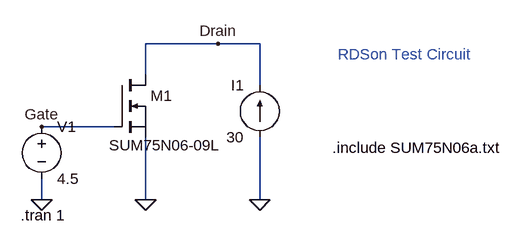
[diagram p0: schematic mosfet_test_circuit_rds.asc]
mosfet_test_circuit_rds.asc, the LTspice schematic file:
Version 4
SHEET 1 880 680
WIRE 320 80 208 80
WIRE 384 80 320 80
WIRE 208 128 208 80
WIRE 384 144 384 80
WIRE 160 208 48 208
WIRE 48 320 48 288
WIRE 208 320 208 224
WIRE 384 320 384 224
FLAG 48 320 0
FLAG 384 320 0
FLAG 208 320 0
FLAG 48 208 Gate
FLAG 320 80 Drain
SYMBOL nmos 160 128 R0
WINDOW 3 -8 108 Left 2
SYMATTR InstName M1
SYMATTR Value SUM75N06-09L
SYMBOL voltage 48 192 R0
WINDOW 123 0 0 Left 2
WINDOW 39 0 0 Left 2
SYMATTR InstName V1
SYMATTR Value 4.5
SYMBOL current 384 224 R180
WINDOW 0 24 80 Left 2
WINDOW 3 24 0 Left 2
WINDOW 123 0 0 Left 2
WINDOW 39 24 -28 Left 2
SYMATTR InstName I1
SYMATTR Value 30
TEXT 16 344 Left 2 !.tran 1
TEXT 496 240 Left 2 !.include SUM75N06a.txt
TEXT 504 96 Left 2 ;RDSon Test Circuit

The netlist it stands for:
* mosfet_test_circuit_rds.asc
M1 Drain Gate 0 0 SUM75N06-09L
V1 Gate 0 4.5
I1 0 Drain 30
.model NMOS NMOS
.model PMOS PMOS
.lib standard.mos
.tran 1
.include SUM75N06a.txt
* RDSon Test Circuit
.backanno
.end